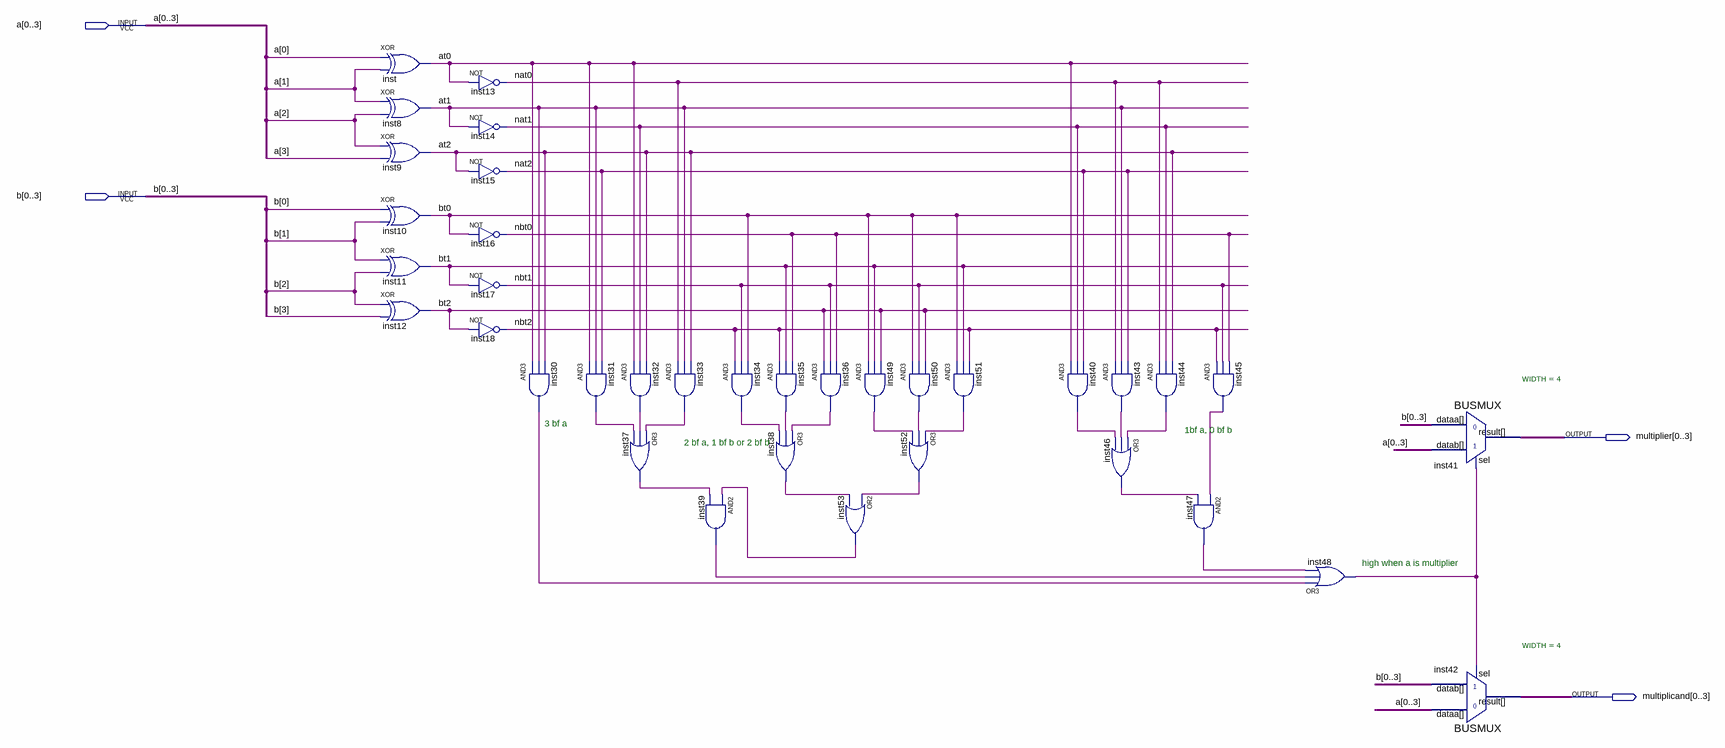
[diagram p0: schematic sheet]
// Quartus schematic bit_flips.bdf as structural Verilog: 36 symbols, 4 pins
module bit_flips (
  input  [0:3] a,
  input  [0:3] b,
  output [0:3] multiplier,
  output [0:3] multiplicand
);

  wire at0, at1, at2, bt0, bt1, bt2, inst30_out, inst31_out, inst32_out, inst33_out, inst34_out, inst35_out,
       inst36_out, inst37_out, inst38_out, inst39_out, inst40_out, inst43_out, inst44_out, inst45_out,
       inst46_out, inst47_out, inst48_out, inst49_out, inst50_out, inst51_out, inst52_out, inst53_out, nat0,
       nat1, nat2, nbt0, nbt1, nbt2;

  xor inst (at0, a[0], a[1]);
  xor inst8 (at1, a[1], a[2]);
  xor inst9 (at2, a[2], a[3]);
  xor inst10 (bt0, b[0], b[1]);
  xor inst11 (bt1, b[1], b[2]);
  xor inst12 (bt2, b[2], b[3]);
  not inst13 (nat0, at0);
  not inst14 (nat1, at1);
  not inst15 (nat2, at2);
  not inst16 (nbt0, bt0);
  not inst17 (nbt1, bt1);
  not inst18 (nbt2, bt2);
  and inst30 (inst30_out, at0, at1, at2);
  and inst31 (inst31_out, at0, at1, nat2);
  and inst32 (inst32_out, at0, nat1, at2);
  or inst37 (inst37_out, inst33_out, inst32_out, inst31_out);
  and inst33 (inst33_out, nat0, at1, at2);
  and inst39 (inst39_out, inst53_out, inst37_out);
  and inst34 (inst34_out, nbt2, nbt1, bt0);
  and inst35 (inst35_out, nbt2, bt1, nbt0);
  or inst38 (inst38_out, inst36_out, inst35_out, inst34_out);
  and inst36 (inst36_out, bt2, nbt1, nbt0);
  and inst49 (inst49_out, bt0, bt1, bt2);
  or inst53 (inst53_out, inst52_out, inst38_out);
  and inst50 (inst50_out, bt0, nbt1, bt2);
  or inst52 (inst52_out, inst51_out, inst50_out, inst49_out);
  and inst51 (inst51_out, bt0, bt1, nbt2);
  and inst40 (inst40_out, at0, nat1, nat2);
  and inst43 (inst43_out, nat0, at1, nat2);
  or inst46 (inst46_out, inst44_out, inst43_out, inst40_out);
  and inst44 (inst44_out, nat0, nat1, at2);
  and inst45 (inst45_out, nbt2, nbt1, nbt0);
  and inst47 (inst47_out, inst45_out, inst46_out);
  or inst48 (inst48_out, inst30_out, inst39_out, inst47_out);
  BUSMUX #(.WIDTH(4)) inst41 (.datab(a), .sel(inst48_out), .dataa(b), .result(multiplier));
  BUSMUX #(.WIDTH(4)) inst42 (.datab(b), .sel(inst48_out), .dataa(a), .result(multiplicand));

  // Notes on the sheet:
  //   3 bf a
  //   1bf a, 0 bf b
  //   2 bf a, 1 bf b or 2 bf b
  //   high when a is multiplier
endmodule
